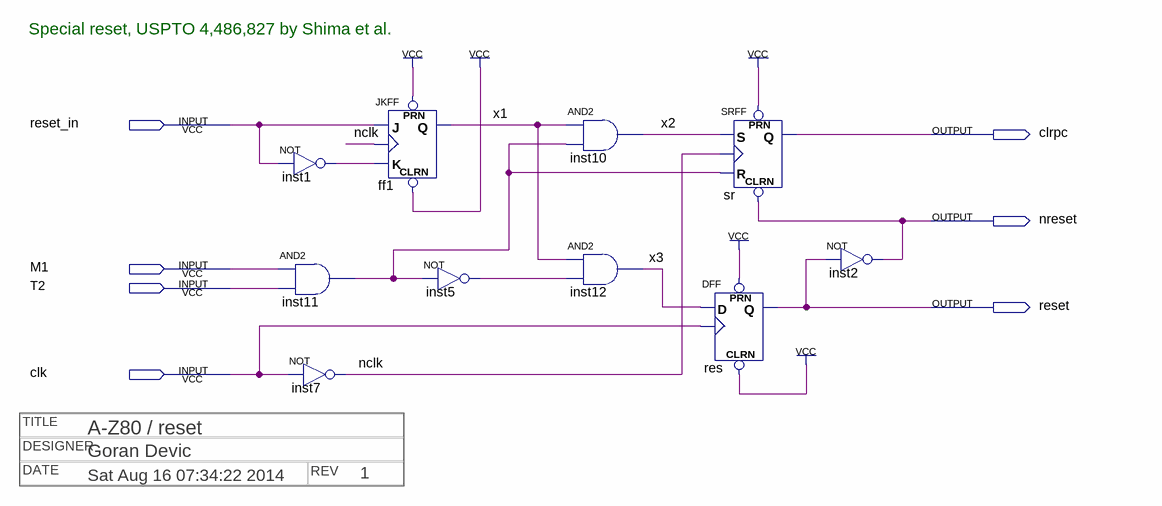
[diagram p0: schematic sheet]
// Quartus schematic reset.bdf as structural Verilog: 10 symbols, 7 pins
// Title block: TITLE: A-Z80 / reset; DESIGNER: Goran Devic; DATE: Sat Aug 16 07:34:22 2014; REV: 1
module reset (
  input  reset_in,
  input  M1,
  input  T2,
  input  clk,
  output clrpc,
  output nreset,
  output reset
);

  wire inst1_out, inst5_out, inst11_out, nclk, x1, x2, x3;

  not inst1 (inst1_out, reset_in);
  and inst11 (inst11_out, M1, T2);
  not inst7 (nclk, clk);
  JKFF ff1 (.PRN(1'b1), .CLRN(1'b1), .K(inst1_out), .J(reset_in), .CLK(nclk), .Q(x1));
  not inst5 (inst5_out, inst11_out);
  and inst10 (x2, x1, inst11_out);
  and inst12 (x3, x1, inst5_out);
  SRFF sr (.PRN(1'b1), .CLRN(nreset), .S(x2), .R(inst11_out), .CLK(nclk), .Q(clrpc));
  DFF res (.CLRN(1'b1), .CLK(clk), .D(x3), .PRN(1'b1), .Q(reset));
  not inst2 (nreset, reset);

  // Notes on the sheet:
  //   Special reset, USPTO 4,486,827 by Shima et al.
endmodule
